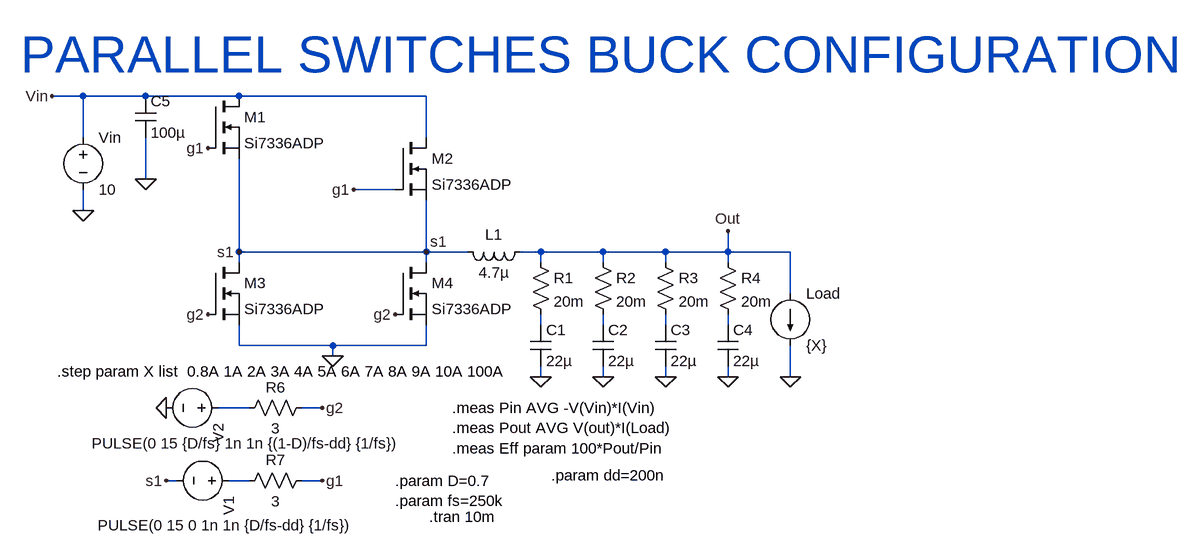
[diagram p0: schematic ParallelBuck2.asc]
ParallelBuck2.asc, the LTspice schematic file:
Version 4
SHEET 1 1676 856
WIRE -240 176 -288 176
WIRE -144 176 -240 176
WIRE 0 176 -144 176
WIRE 288 176 0 176
WIRE -240 240 -240 176
WIRE 288 240 288 176
WIRE -144 304 -144 240
WIRE 240 320 176 320
WIRE -240 352 -240 320
WIRE 0 416 0 272
WIRE 288 416 288 336
WIRE 288 416 0 416
WIRE 352 416 288 416
WIRE 464 416 432 416
WIRE 560 416 464 416
WIRE 656 416 560 416
WIRE 752 416 752 384
WIRE 752 416 656 416
WIRE 848 416 752 416
WIRE 0 432 0 416
WIRE 288 432 288 416
WIRE 464 432 464 416
WIRE 560 432 560 416
WIRE 656 432 656 416
WIRE 752 432 752 416
WIRE 848 480 848 416
WIRE 464 528 464 512
WIRE 560 528 560 512
WIRE 656 528 656 512
WIRE 752 528 752 512
WIRE 0 560 0 528
WIRE 144 560 0 560
WIRE 288 560 288 528
WIRE 288 560 144 560
WIRE 144 576 144 560
WIRE 464 608 464 592
WIRE 560 608 560 592
WIRE 656 608 656 592
WIRE 752 608 752 592
WIRE 848 608 848 560
WIRE 16 656 -32 656
WIRE 128 656 96 656
WIRE -96 768 -112 768
WIRE 16 768 -16 768
WIRE 128 768 96 768
FLAG 128 768 g1
FLAG -112 768 s1
FLAG 128 656 g2
FLAG -112 656 0
FLAG -240 352 0
FLAG -288 176 Vin
FLAG -48 256 g1
FLAG 0 416 s1
FLAG 176 320 g1
FLAG 288 416 s1
FLAG -48 512 g2
FLAG 240 512 g2
FLAG 144 576 0
FLAG 464 608 0
FLAG 560 608 0
FLAG 656 608 0
FLAG 752 608 0
FLAG 848 608 0
FLAG 752 384 Out
FLAG -144 304 0
SYMBOL voltage 0 768 R90
WINDOW 123 0 0 Left 0
WINDOW 39 0 0 Left 0
WINDOW 3 69 -175 VRight 2
SYMATTR Value PULSE(0 15 0 1n 1n {D/fs-dd} {1/fs})
SYMATTR InstName V1
SYMBOL voltage -16 656 R90
WINDOW 123 0 0 Left 0
WINDOW 39 0 0 Left 0
WINDOW 3 55 -266 VRight 2
SYMATTR Value PULSE(0 15 {D/fs} 1n 1n {(1-D)/fs-dd} {1/fs})
SYMATTR InstName V2
SYMBOL voltage -240 224 R0
SYMATTR InstName Vin
SYMATTR Value 10
SYMBOL nmos -48 176 R0
SYMATTR InstName M1
SYMATTR Value Si7336ADP
SYMBOL nmos 240 240 R0
SYMATTR InstName M2
SYMATTR Value Si7336ADP
SYMBOL nmos -48 432 R0
SYMATTR InstName M3
SYMATTR Value Si7336ADP
SYMBOL nmos 240 432 R0
SYMATTR InstName M4
SYMATTR Value Si7336ADP
SYMBOL ind 448 400 R90
WINDOW 0 5 56 VBottom 2
WINDOW 3 32 56 VTop 2
SYMATTR InstName L1
SYMATTR Value 4.7µ
SYMBOL cap 448 528 R0
SYMATTR InstName C1
SYMATTR Value 22µ
SYMBOL res 448 416 R0
SYMATTR InstName R1
SYMATTR Value 20m
SYMBOL cap 544 528 R0
SYMATTR InstName C2
SYMATTR Value 22µ
SYMBOL res 544 416 R0
SYMATTR InstName R2
SYMATTR Value 20m
SYMBOL cap 640 528 R0
SYMATTR InstName C3
SYMATTR Value 22µ
SYMBOL res 640 416 R0
SYMATTR InstName R3
SYMATTR Value 20m
SYMBOL cap 736 528 R0
SYMATTR InstName C4
SYMATTR Value 22µ
SYMBOL res 736 416 R0
SYMATTR InstName R4
SYMATTR Value 20m
SYMBOL current 848 480 R0
SYMATTR InstName Load
SYMATTR Value {X}
SYMBOL res 112 640 R90
WINDOW 0 0 56 VBottom 2
WINDOW 3 32 56 VTop 2
SYMATTR InstName R6
SYMATTR Value 3
SYMBOL res 112 752 R90
WINDOW 0 0 56 VBottom 2
WINDOW 3 32 56 VTop 2
SYMATTR InstName R7
SYMATTR Value 3
SYMBOL cap -160 176 R0
SYMATTR InstName C5
SYMATTR Value 100µ
TEXT 240 768 Left 2 !.param D=0.7\n.param fs=250k
TEXT 480 760 Left 2 !.param dd=200n
TEXT 292 824 Left 2 !.tran 10m
TEXT 328 656 Left 2 !.meas Pin AVG -V(Vin)*I(Vin)\n.meas Pout AVG V(out)*I(Load)\n.meas Eff param 100*Pout/Pin
TEXT -280 600 Left 2 !.step param X list  0.8A 1A 2A 3A 4A 5A 6A 7A 8A 9A 10A 100A
TEXT -336 112 Left 6 ;PARALLEL SWITCHES BUCK CONFIGURATION

The netlist it stands for:
* ParallelBuck2.asc
V1 N006 s1 PULSE(0 15 0 1n 1n {D/fs-dd} {1/fs})
V2 N005 0 PULSE(0 15 {D/fs} 1n 1n {(1-D)/fs-dd} {1/fs})
Vin Vin 0 10
M1 Vin g1 s1 s1 Si7336ADP
M2 Vin g1 s1 s1 Si7336ADP
M3 s1 g2 0 0 Si7336ADP
M4 s1 g2 0 0 Si7336ADP
L1 Out s1 4.7µ
C1 N001 0 22µ
R1 Out N001 20m
C2 N002 0 22µ
R2 Out N002 20m
C3 N003 0 22µ
R3 Out N003 20m
C4 N004 0 22µ
R4 Out N004 20m
I§Load Out 0 {X}
R6 g2 N005 3
R7 g1 N006 3
C5 Vin 0 100µ
.model NMOS NMOS
.model PMOS PMOS
.lib standard.mos
.param D=0.7
.param fs=250k
.param dd=200n
.tran 10m
.meas Pin AVG -V(Vin)*I(Vin)
.meas Pout AVG V(out)*I(Load)
.meas Eff param 100*Pout/Pin
.step param X list  0.8A 1A 2A 3A 4A 5A 6A 7A 8A 9A 10A 100A
* PARALLEL SWITCHES BUCK CONFIGURATION
.backanno
.end